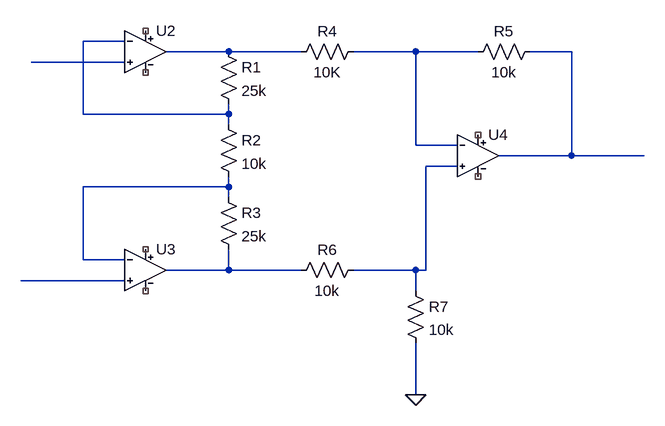
[diagram p0: schematic instrumental amplifier.asc]
instrumental amplifier.asc, the LTspice schematic file:
Version 4
SHEET 1 880 680
WIRE 64 96 0 96
WIRE 224 112 128 112
WIRE 336 112 224 112
WIRE 512 112 416 112
WIRE 608 112 512 112
WIRE 752 112 688 112
WIRE 64 128 -80 128
WIRE 0 208 0 96
WIRE 224 208 224 192
WIRE 224 208 0 208
WIRE 224 224 224 208
WIRE 512 256 512 112
WIRE 576 256 512 256
WIRE 752 272 752 112
WIRE 752 272 640 272
WIRE 864 272 752 272
WIRE 576 288 528 288
WIRE 224 320 224 304
WIRE 224 320 0 320
WIRE 224 336 224 320
WIRE 0 432 0 320
WIRE 64 432 0 432
WIRE 224 448 224 416
WIRE 224 448 128 448
WIRE 336 448 224 448
WIRE 512 448 416 448
WIRE 528 448 528 288
WIRE 528 448 512 448
WIRE 64 464 -96 464
WIRE 512 480 512 448
WIRE 512 640 512 560
FLAG 512 640 0
SYMBOL TL074 96 112 R0
SYMATTR InstName U2
SYMBOL TL074 96 448 R0
SYMATTR InstName U3
SYMBOL TL074 608 272 R0
SYMATTR InstName U4
SYMBOL res 208 96 R0
SYMATTR InstName R1
SYMATTR Value 25k
SYMBOL res 208 208 R0
SYMATTR InstName R2
SYMATTR Value 10k
SYMBOL res 208 320 R0
SYMATTR InstName R3
SYMATTR Value 25k
SYMBOL res 432 96 R90
WINDOW 0 0 56 VBottom 2
WINDOW 3 32 56 VTop 2
SYMATTR InstName R4
SYMATTR Value 10K
SYMBOL res 704 96 R90
WINDOW 0 0 56 VBottom 2
WINDOW 3 32 56 VTop 2
SYMATTR InstName R5
SYMATTR Value 10k
SYMBOL res 432 432 R90
WINDOW 0 0 56 VBottom 2
WINDOW 3 32 56 VTop 2
SYMATTR InstName R6
SYMATTR Value 10k
SYMBOL res 496 464 R0
SYMATTR InstName R7
SYMATTR Value 10k

The netlist it stands for:
* instrumental amplifier.asc
XU2 N005 N001 NC_01 NC_02 N002 TL074  ; pins In+ In- V+ V- OUT
XU3 N009 N007 NC_03 NC_04 N008 TL074  ; pins In+ In- V+ V- OUT
XU4 N006 N003 NC_05 NC_06 N004 TL074  ; pins In+ In- V+ V- OUT
R1 N002 N001 25k
R2 N001 N007 10k
R3 N007 N008 25k
R4 N003 N002 10K
R5 N004 N003 10k
R6 N006 N008 10k
R7 N006 0 10k
.lib C:\Users\thusa.THUSA\Downloads\sloj068\TL074.301
.backanno
.end